# Altium schematic sheet Power.SchDoc
size A4
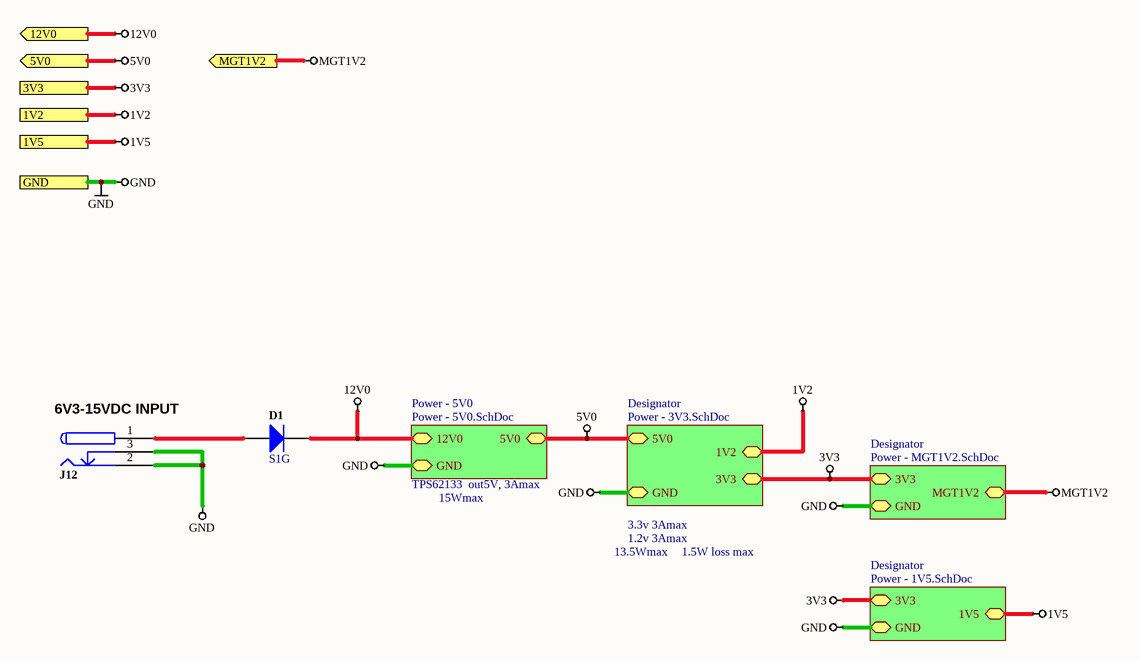
[diagram p0: Power.SchDoc]

## Parts
D1  S1G  [DO-214AC]
J12  PWR CONNECTOR  [PJ-102AH]  (value not drawn)

## Sub-sheets
Designator = Power - 3V3.SchDoc: 5V0, GND, 3V3, 1V2
Designator = Power - MGT1V2.SchDoc: 3V3, GND, MGT1V2
Designator = Power - 1V5.SchDoc: 3V3, GND, 1V5
Power - 5V0 = Power - 5V0.SchDoc: 12V0, GND, 5V0

## Ports
1V2, 1V5, 3V3, 5V0, 12V0, GND, MGT1V2

## Nets
1V2: port 1V2, sheet Designator/1V2
1V5: port 1V5, sheet Designator/1V5
3V3: port 3V3, sheet Designator/3V3, sheet Designator/3V3, sheet Designator/3V3
5V0: port 5V0, sheet Power - 5V0/5V0, sheet Designator/5V0
12V0: D1.2 ; port 12V0, sheet Power - 5V0/12V0
GND: J12.2 J12.3 ; port GND, sheet Power - 5V0/GND, sheet Designator/GND, sheet Designator/GND, sheet Designator/GND
MGT1V2: port MGT1V2, sheet Designator/MGT1V2
NetD1_1: D1.1 J12.1

## Notes on the sheet
- (near J12) 6V3-15VDC INPUT
- TPS62133  out5V, 3Amax
- 15Wmax
- 3.3v 3Amax
- 1.2v 3Amax
- 13.5Wmax
- 1.5W loss max

## Library data of the parts
D1 = S1G: Fairchild S1G General Purpose Rectifier; Vrrm: 400V; If(AV): 1.0A; Ifsm: 30A; Pd: 1.4W; Trr: 1.8uS; Ct: 6.6pF; Package: DO-214AC; Manufacturer_PN: S1G; Manufacturer Part Number: S1G
J12 = POWER-CONNECTOR-3: Connector, 3 Conductor Power Jack; Manufacturer_PN: CP-102AH-ND; Connector type: POWERJACK 3 HEADER; ClassName: PWR_CONN_5V0; Category: Connector; Mounting Technology: PTH; Pin Count: 3; Manufacturer Part Number: CP-102AH-ND